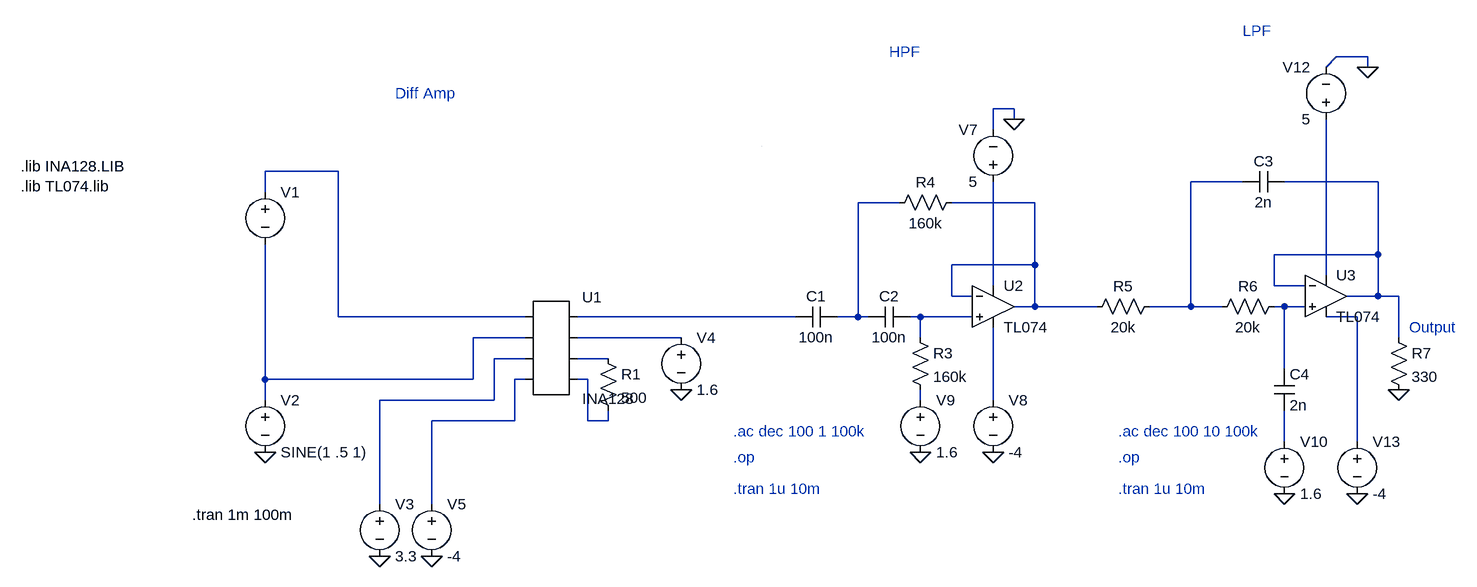
[diagram p0: schematic all.asc]
all.asc, the LTspice schematic file:
Version 4
SHEET 1 2640 680
WIRE 2032 -240 1984 -240
WIRE 1968 -224 1984 -240
WIRE 2032 -224 2032 -240
WIRE 1488 -160 1456 -160
WIRE 1488 -144 1488 -160
WIRE 1456 -128 1456 -160
WIRE 448 -64 336 -64
WIRE 1840 -48 1760 -48
WIRE 2048 -48 1904 -48
WIRE 336 -32 336 -64
WIRE 1312 -16 1248 -16
WIRE 1520 -16 1392 -16
WIRE 2048 64 2048 -48
WIRE 2048 64 1888 64
WIRE 1520 80 1520 -16
WIRE 1520 80 1392 80
WIRE 1968 96 1968 -144
WIRE 1456 112 1456 -48
WIRE 1888 112 1888 64
WIRE 1936 112 1888 112
WIRE 1392 128 1392 80
WIRE 1424 128 1392 128
WIRE 2048 128 2048 64
WIRE 2048 128 2000 128
WIRE 2080 128 2048 128
WIRE 1520 144 1520 80
WIRE 1520 144 1488 144
WIRE 1616 144 1520 144
WIRE 1760 144 1760 -48
WIRE 1760 144 1696 144
WIRE 1808 144 1760 144
WIRE 1904 144 1888 144
WIRE 1936 144 1904 144
WIRE 448 160 448 -64
WIRE 736 160 448 160
WIRE 1152 160 816 160
WIRE 1248 160 1248 -16
WIRE 1248 160 1216 160
WIRE 1264 160 1248 160
WIRE 1344 160 1328 160
WIRE 1424 160 1344 160
WIRE 2016 160 1968 160
WIRE 736 192 656 192
WIRE 976 192 816 192
WIRE 1344 192 1344 160
WIRE 2080 192 2080 128
WIRE 736 224 688 224
WIRE 864 224 816 224
WIRE 1904 240 1904 144
WIRE 336 256 336 48
WIRE 656 256 656 192
WIRE 656 256 336 256
WIRE 736 256 720 256
WIRE 832 256 816 256
WIRE 336 288 336 256
WIRE 688 288 688 224
WIRE 688 288 512 288
WIRE 1344 288 1344 272
WIRE 1456 288 1456 176
WIRE 720 320 720 256
WIRE 720 320 592 320
WIRE 832 320 832 256
WIRE 864 320 864 304
WIRE 864 320 832 320
WIRE 1904 352 1904 304
WIRE 2016 352 2016 160
WIRE 512 448 512 288
WIRE 592 448 592 320
FLAG 336 368 0
FLAG 512 528 0
FLAG 976 272 0
FLAG 592 528 0
FLAG 1488 -144 0
FLAG 1456 368 0
FLAG 1344 368 0
FLAG 1904 432 0
FLAG 2016 432 0
FLAG 2032 -224 0
FLAG 2080 272 0
SYMBOL voltage 336 -48 R0
WINDOW 39 0 0 Left 0
WINDOW 3 24 96 Invisible 2
SYMATTR InstName V1
SYMATTR Value SINE(0 0.001 200 0 0 0 0)
SYMATTR Value2 AC 0.001
SYMBOL voltage 336 272 R0
SYMATTR InstName V2
SYMATTR Value SINE(1 .5 1)
SYMBOL voltage 512 432 R0
SYMATTR InstName V3
SYMATTR Value 3.3
SYMBOL voltage 976 176 R0
SYMATTR InstName V4
SYMATTR Value 1.6
SYMBOL AutoGenerated/INA128 768 208 R0
SYMATTR InstName U1
SYMBOL Res 848 208 R0
SYMATTR InstName R1
SYMATTR Value 500
SYMBOL voltage 592 432 R0
SYMATTR InstName V5
SYMATTR Value -4
SYMBOL cap 1216 144 R90
WINDOW 0 0 32 VBottom 2
WINDOW 3 32 32 VTop 2
SYMATTR InstName C1
SYMATTR Value 100n
SYMATTR SpiceLine Lser=0 mfg="   ---" pn="   ---" type="   ---"
SYMBOL cap 1328 144 R90
WINDOW 0 0 32 VBottom 2
WINDOW 3 32 32 VTop 2
SYMATTR InstName C2
SYMATTR Value 100n
SYMATTR SpiceLine Lser=408p mfg="   ---" pn="   ---" type="   ---"
SYMBOL Res 1328 176 R0
SYMATTR InstName R3
SYMATTR Value 160k
SYMBOL Res 1408 -32 R90
WINDOW 0 0 56 VBottom 2
WINDOW 3 32 56 VTop 2
SYMATTR InstName R4
SYMATTR Value 160k
SYMBOL voltage 1456 -32 R180
WINDOW 0 24 96 Left 2
WINDOW 3 24 16 Left 2
SYMATTR InstName V7
SYMATTR Value 5
SYMBOL voltage 1456 272 R0
SYMATTR InstName V8
SYMATTR Value -4
SYMBOL OpAmps/opamp2 1456 80 R0
SYMATTR InstName U2
SYMATTR Value TL074
SYMBOL voltage 1344 272 R0
SYMATTR InstName V9
SYMATTR Value 1.6
SYMBOL Res 1712 128 R90
WINDOW 0 0 56 VBottom 2
WINDOW 3 32 56 VTop 2
SYMATTR InstName R5
SYMATTR Value 20k
SYMBOL Res 1904 128 R90
WINDOW 0 0 56 VBottom 2
WINDOW 3 32 56 VTop 2
SYMATTR InstName R6
SYMATTR Value 20k
SYMBOL cap 1904 -64 R90
WINDOW 0 0 32 VBottom 2
WINDOW 3 32 32 VTop 2
SYMATTR InstName C3
SYMATTR Value 2n
SYMATTR SpiceLine Rser=52.6m Lser=228p mfg="   ---" pn="   ---" type="   ---"
SYMBOL OpAmps/opamp2 1968 64 R0
SYMATTR InstName U3
SYMATTR Value TL074
SYMBOL cap 1888 240 R0
SYMATTR InstName C4
SYMATTR Value 2n
SYMATTR SpiceLine Rser=52.5m Lser=416p mfg="   ---" pn="   ---" type="   ---"
SYMBOL voltage 1904 336 R0
SYMATTR InstName V10
SYMATTR Value 1.6
SYMBOL voltage 1968 -128 R180
WINDOW 0 24 96 Left 2
WINDOW 3 24 16 Left 2
SYMATTR InstName V12
SYMATTR Value 5
SYMBOL voltage 2016 336 R0
SYMATTR InstName V13
SYMATTR Value -4
SYMBOL Res 2064 176 R0
SYMATTR InstName R7
SYMATTR Value 330
TEXT 224 464 Left 2 !.tran 1m 100m
TEXT -40 -72 Left 2 !.lib INA128.LIB\n.lib TL074.lib
TEXT 1056 336 Left 2 ;.ac dec 100 1 100k
TEXT 1056 376 Left 2 ;.op
TEXT 1056 424 Left 2 ;.tran 1u 10m
TEXT 1648 336 Left 2 ;.ac dec 100 10 100k
TEXT 1648 376 Left 2 ;.op
TEXT 1648 424 Left 2 ;.tran 1u 10m
TEXT 536 -184 Left 2 ;Diff Amp
TEXT 1296 -248 Left 2 ;HPF
TEXT 1840 -280 Left 2 ;LPF
TEXT 2096 176 Left 2 ;Output
ARC Normal 1100 -92 1092 -112 1380 -136 1276 -144 2

The netlist it stands for:
* all.asc
V1 N001 N012 SINE(0 0.001 200 0 0 0 0) AC 0.001
V2 N012 0 SINE(1 .5 1)
V3 N014 0 3.3
V4 N013 0 1.6
* U1: INA128 (symbol AutoGenerated/INA128 not available, pins judged from their places): pin1=N001 pin2=N012 pin3=N014 pin4=N016 pin5=N009 pin6=N013 pin7=N015 pin8=N017
R1 N015 N017 500
V5 N016 0 -4
C1 N004 N009 100n Lser=0 mfg="   ---" pn="   ---" type="   ---"
C2 N010 N004 100n Lser=408p mfg="   ---" pn="   ---" type="   ---"
R3 N010 N018 160k
R4 N005 N004 160k
V7 N007 0 5
V8 N019 0 -4
XU2 N010 N005 N007 N019 N005 TL074  ; pins In+ In- V+ V- OUT
V9 N018 0 1.6
R5 N002 N005 20k
R6 N008 N002 20k
C3 N003 N002 2n Rser=52.6m Lser=228p mfg="   ---" pn="   ---" type="   ---"
XU3 N008 N003 N006 N011 N003 TL074  ; pins In+ In- V+ V- OUT
C4 N008 N020 2n Rser=52.5m Lser=416p mfg="   ---" pn="   ---" type="   ---"
V10 N020 0 1.6
V12 N006 0 5
V13 N011 0 -4
R7 N003 0 330
.tran 1m 100m
.lib INA128.LIB
.lib TL074.lib
* .ac dec 100 1 100k
* .op
* .tran 1u 10m
* .ac dec 100 10 100k
* .op
* .tran 1u 10m
* Diff Amp
* HPF
* LPF
* Output
.backanno
.end